# EAGLE design H00R1 (EAGLE 9.6.1)
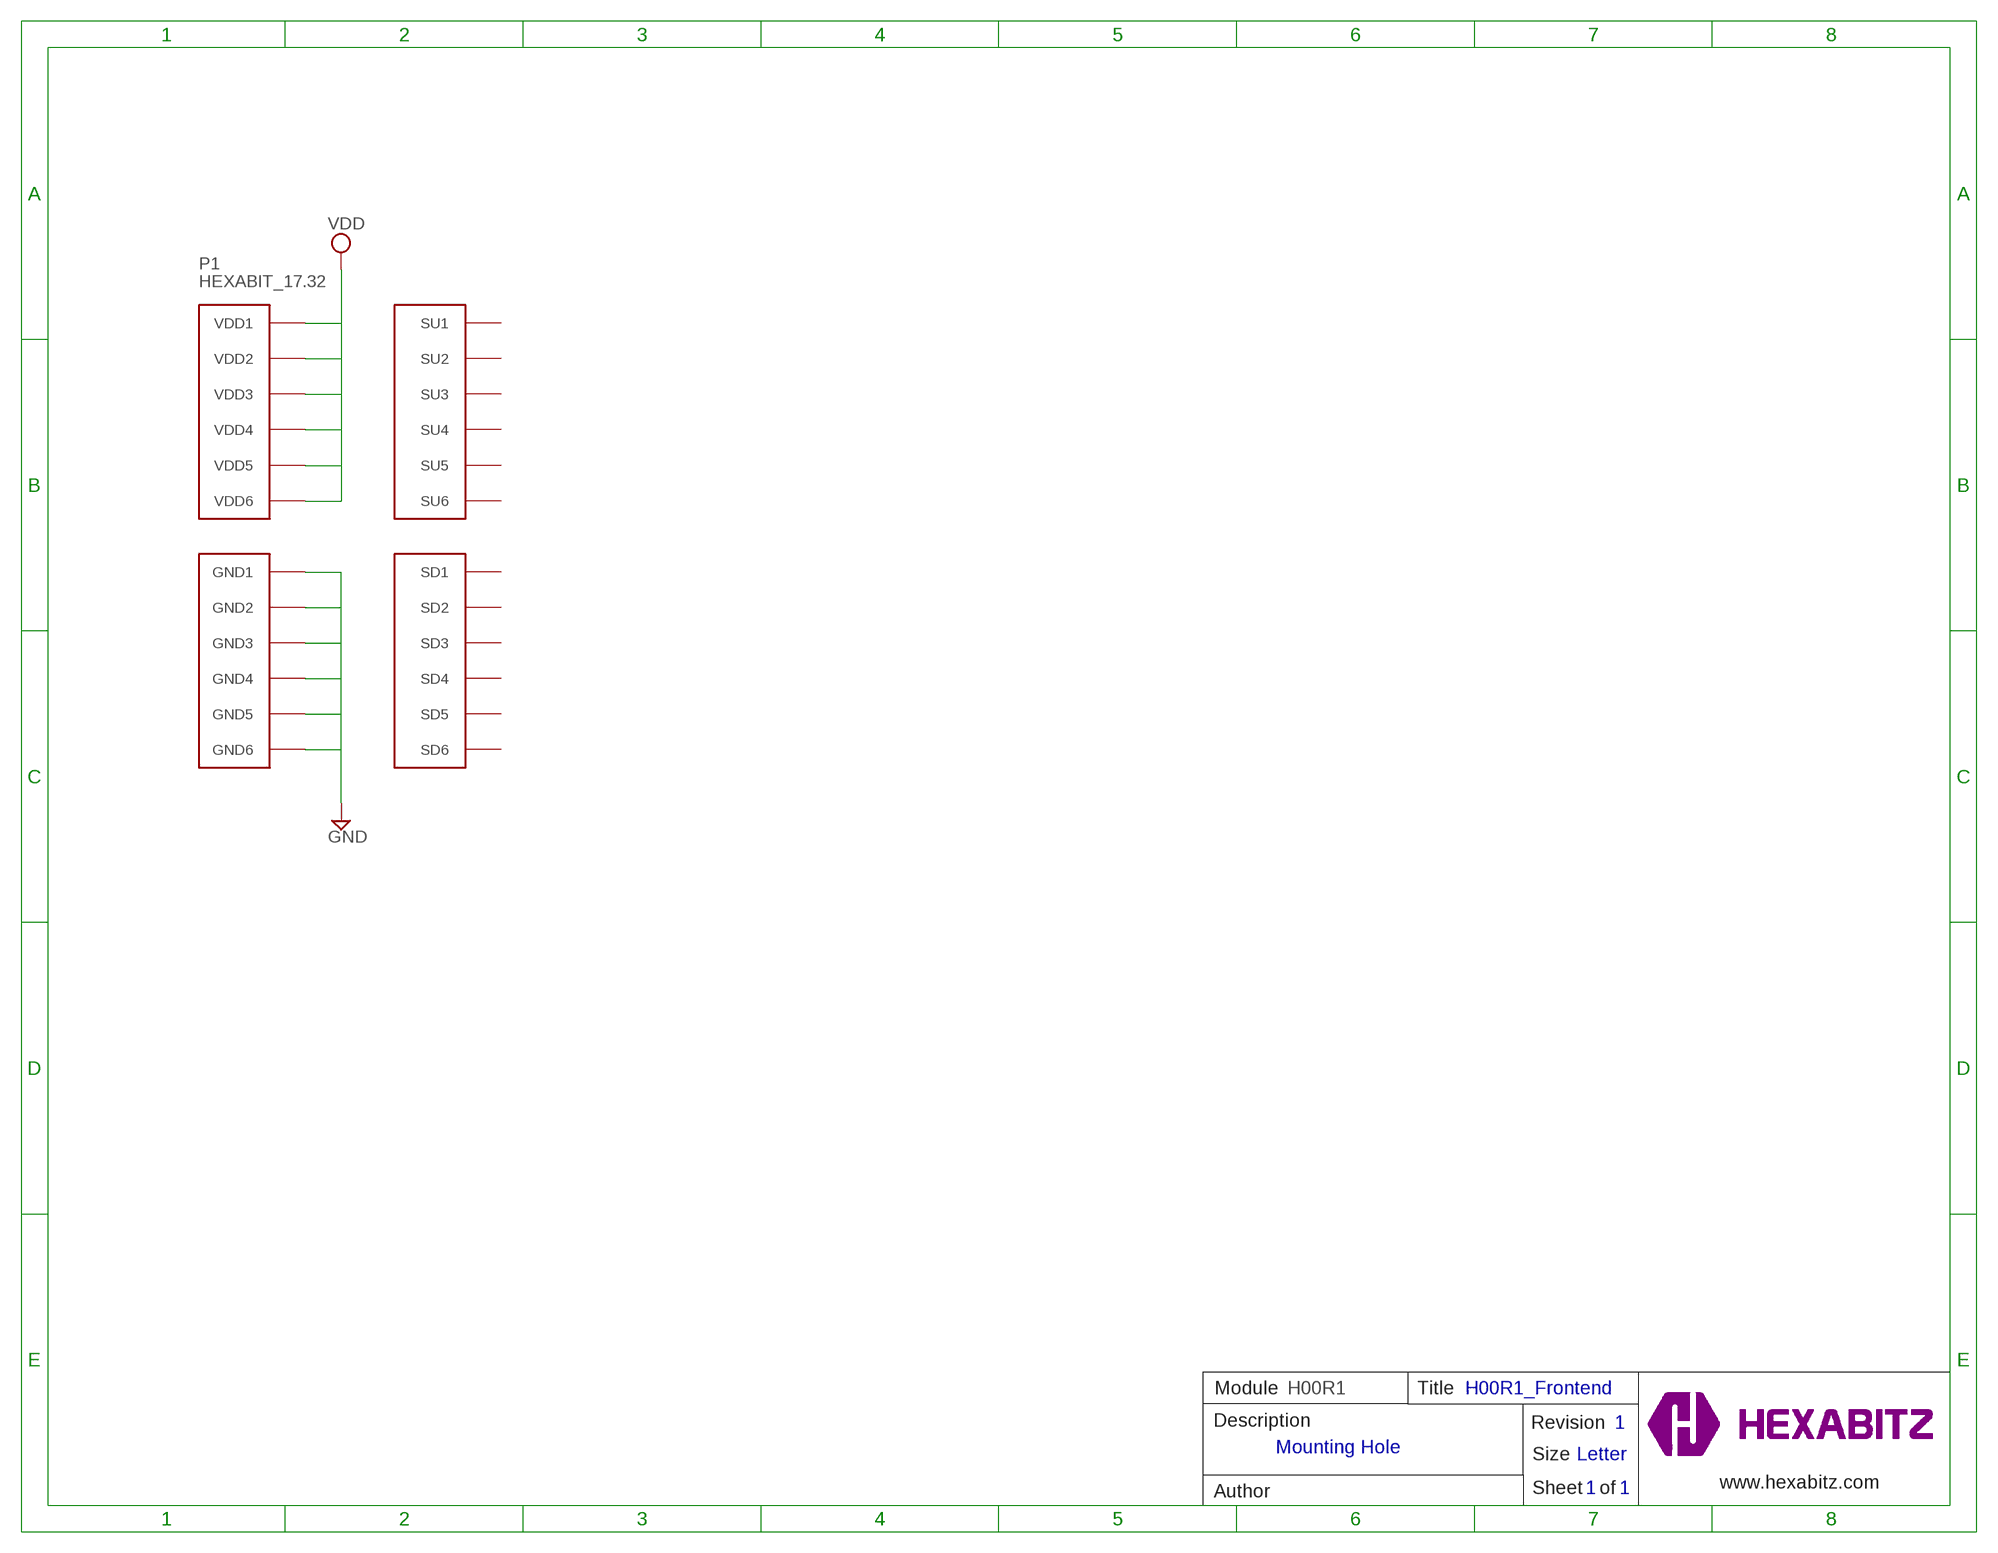
[diagram p0: schematic, sheet 1]

## Parts
P1  HEXABIT_17.32  [HEXABIT_17.32]
TRIMBLE-LOGO1  HEXA-LOGO  [HEXA-LOGO]

## Nets
GND: P1.PAD_PD7(GND1) P1.PAD_PD8(GND2) P1.PAD_PD9(GND3) P1.PAD_PD10(GND4) P1.PAD_PD11(GND5) P1.PAD_PD12(GND6)
VDD: P1.PAD_PU7(VDD1) P1.PAD_PU8(VDD2) P1.PAD_PU9(VDD3) P1.PAD_PU10(VDD4) P1.PAD_PU11(VDD5) P1.PAD_PU12(VDD6)
Unconnected: P1.PAD_PD1(SD1) P1.PAD_PD2(SD2) P1.PAD_PD3(SD3) P1.PAD_PD4(SD4) P1.PAD_PD5(SD5) P1.PAD_PD6(SD6) P1.PAD_PU1(SU1) P1.PAD_PU2(SU2) P1.PAD_PU3(SU3) P1.PAD_PU4(SU4) P1.PAD_PU5(SU5) P1.PAD_PU6(SU6)

## Notes on the sheet
- Module | H00R1 | Title | H00R1_Frontend
- Description | Revision | 1
- Mounting Hole
- Size | Letter
- www.hexabitz.com
- Author | Sheet   of | 1 | 1

## Library data of the parts
P1 = hexabitz_connectors:HEXABIT_?: Hexabitz Hexagon Module Connector Hexagon side length = 28.87mm.
TRIMBLE-LOGO1 = HEXABITZ_USER_INTERFACE_PARTS:HEXA-LOGO: Trimble-Logo

## Board
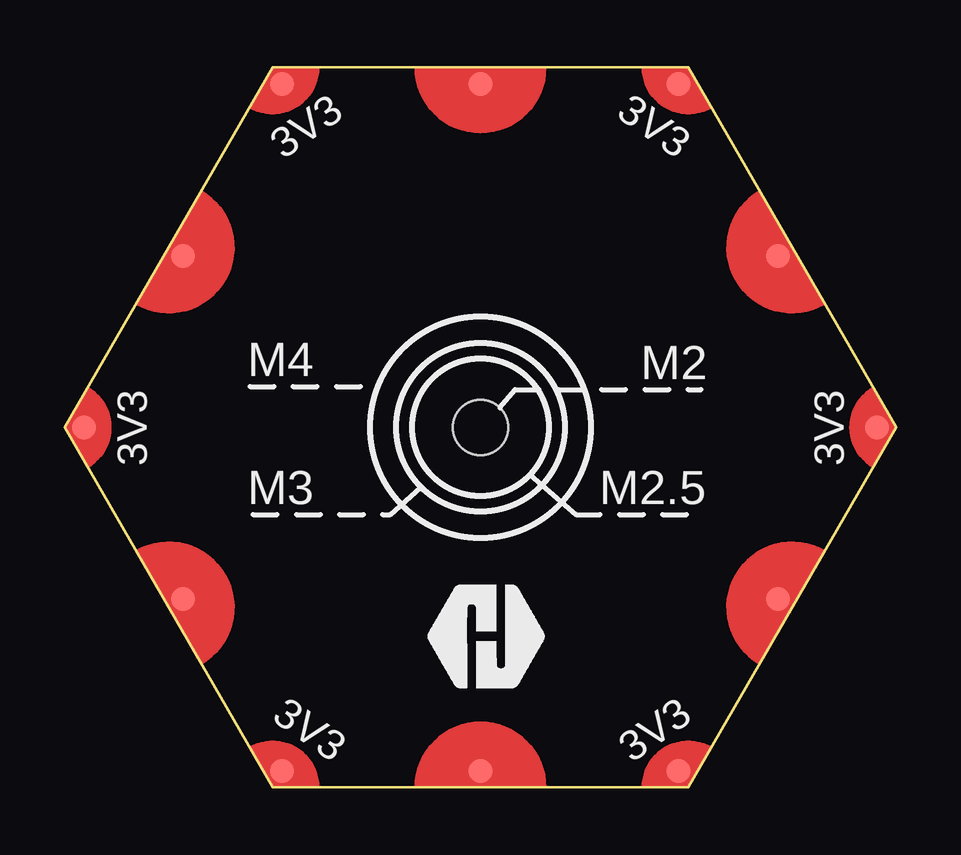
[diagram p1: board, top side]
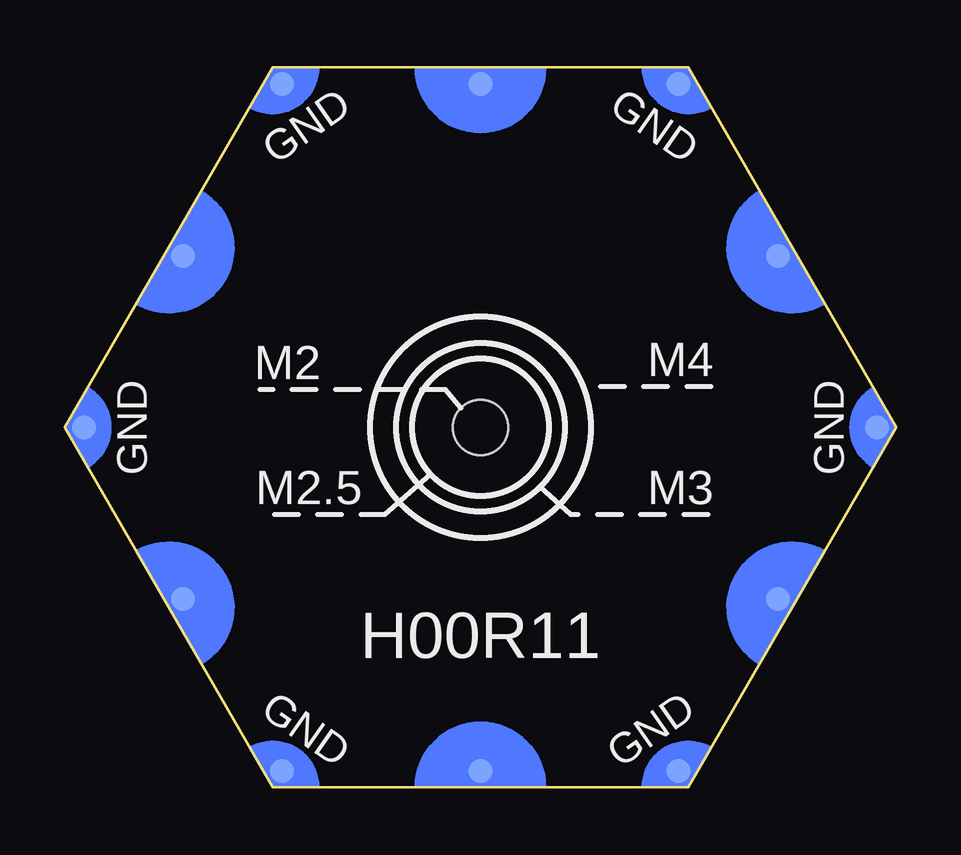
[diagram p2: board, bottom side, seen from below]

Size 34.64 x 30 mm. Coordinates in mm from the lower left corner, seen from the top.
Copper layers (1*16): Top 0.035mm / dielectric 1.5mm / Bottom 0.035mm
Design rules "2_layer *": minimum track width 7mil, minimum drill 10mil, track to track 6mil, track to pad 6mil, pad to pad 32mil, via to via 6mil, smd to smd 0mil, copper to edge 1mil, drill to drill 8mil, minimum pad ring 10mil, minimum via ring 8mil, stop-mask expansion 2mil, vias tented up to drill 15mil, thermal gap 10mil
Holes 2.3 mm at 17.32,15
tRestrict: area 9.2,6.9 to 25.4,23.1
bRestrict: area 9.2,6.9 to 25.4,23.1

### Footprints (pad centres in the part's own frame; a part is rotated, then mirrored left to right if it is on the bottom)
HEXABIT_17.32 = smd 1 x 1 bottom: PAD_PD1 12.39,7.15; PAD_PD2 12.39,-7.15; PAD_PD3 0,-14.31; PAD_PD4 -12.39,-7.15; PAD_PD5 -12.39,7.15; PAD_PD6 0,14.31; PAD_PD7 8.26,14.31; PAD_PD8 16.52,0; PAD_PD9 8.26,-14.31; PAD_PD10 -8.26,-14.31; PAD_PD11 -16.52,0; PAD_PD12 -8.26,14.31 | smd 1 x 1: PAD_PU1 12.39,7.15; PAD_PU2 12.39,-7.15; PAD_PU3 0,-14.31; PAD_PU4 -12.39,-7.15; PAD_PU5 -12.39,7.15; PAD_PU6 0,14.31; PAD_PU7 8.26,14.31; PAD_PU8 16.52,0; PAD_PU9 8.26,-14.31; PAD_PU10 -8.26,-14.31; PAD_PU11 -16.52,0; PAD_PU12 -8.26,14.31

### Placement (x,y rotation side)
P1  17.32,15 0 top
TRIMBLE-LOGO1  17.62,4.13 0 top

### Tracks (layer width: path | path; a pad name or v marks a point on that pad's centre or on a via)
GND
  pour Bottom (no thermals): 8.66,0 25.98,0 34.64,15 25.98,30 8.66,30 0,15
VDD
  pour Top (no thermals): 8.66,0 25.98,0 34.64,15 25.98,30 8.66,30 0,15

### Text on the board
tPlace: 3V3 | 3V3 | M4 | M2 | 3V3 | 3V3 | M3 | M2.5 | 3V3 | 3V3
bPlace: GND | GND | M4 | M2 | GND | GND | M3 | M2.5 | H00R11 | GND | GND